# EAGLE schematic Becca Sap Flow Sensor MOD3 (EAGLE 9.6.2)
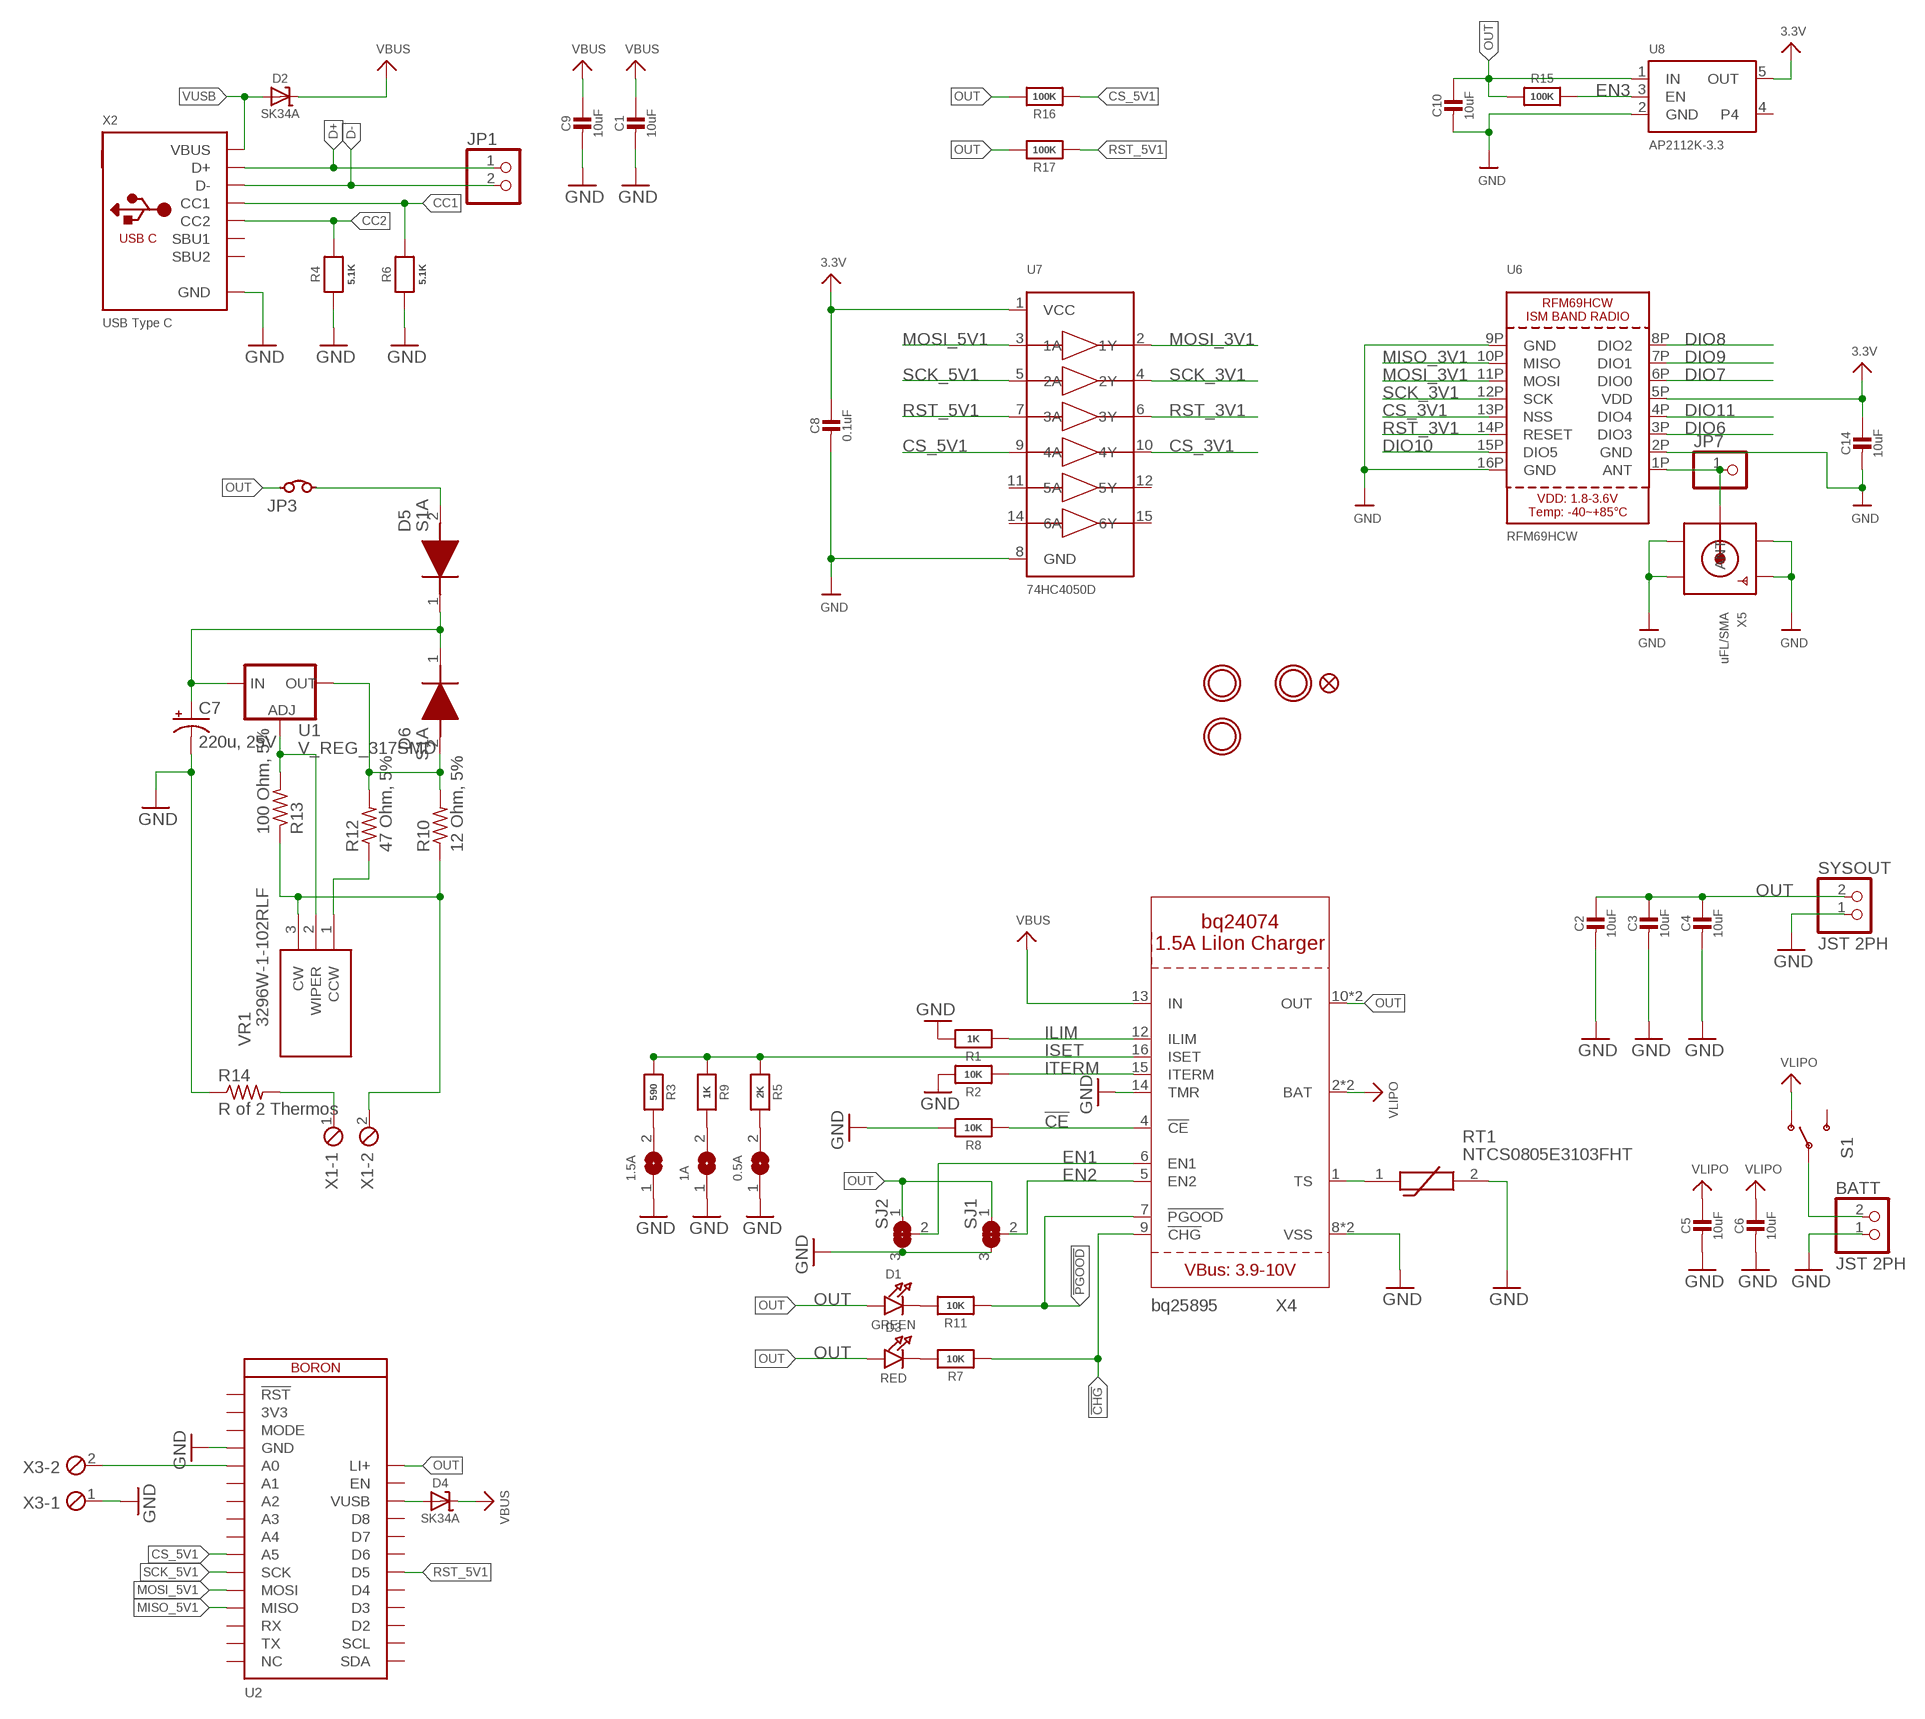
[diagram p0: schematic, sheet 1]

## Parts
0.5A  SOLDERJUMPER  [SOLDERJUMPER_ARROW_NOPASTE]
1.5A  SOLDERJUMPER  [SOLDERJUMPER_ARROW_NOPASTE]
1A  SOLDERJUMPERCLOSED  [SOLDERJUMPER_CLOSEDWIRE]
BATT  JST 2PH  JST_2PIN-THM-RA  [JST-PH-2-THM-RA]
C1  10uF  CAP_CERAMIC0805-NOOUTLINE  [0805-NO]
C2  10uF  CAP_CERAMIC0805-NOOUTLINE  [0805-NO]
C3  10uF  CAP_CERAMIC0805-NOOUTLINE  [0805-NO]
C4  10uF  CAP_CERAMIC0805-NOOUTLINE  [0805-NO]
C5  10uF  CAP_CERAMIC0805-NOOUTLINE  [0805-NO]
C6  10uF  CAP_CERAMIC0805-NOOUTLINE  [0805-NO]
C7  220u, 25V  CPOL-USC  [PANASONIC_C]
C8  0.1uF  CAP_CERAMIC0805-NOOUTLINE  [0805-NO]
C9  10uF  CAP_CERAMIC0805-NOOUTLINE  [0805-NO]
C10  10uF  CAP_CERAMIC0805-NOOUTLINE  [0805-NO]
C14  10uF  CAP_CERAMIC0805-NOOUTLINE  [0805-NO]
D1  GREEN  LED0603  [CHIPLED_0603]
D2  SK34A  DIODE-SCHOTTKYSMA  [SMADIODE]
D3  RED  LED0603  [CHIPLED_0603]
D4  SK34A  DIODE-SCHOTTKYSMA  [SMADIODE]
D5  S1A  [DIOM5027X250N]
D6  S1A  [DIOM5027X250N]
FID2  FIDUCIAL_1MM  [FIDUCIAL_1MM]
JP1  HEADER-1X2ROUND  [1X02_ROUND]
JP3  JUMPER  [HDR2X1]
JP7  HEADER-1X1ROUND  [1X01_ROUND]
R1  1K  RESISTOR_0603_NOOUT  [0603-NO]
R2  10K  RESISTOR_0603_NOOUT  [0603-NO]
R3  590  RESISTOR_0603_NOOUT  [0603-NO]
R4  5.1K  RESISTOR_0603_NOOUT  [0603-NO]
R5  2K  RESISTOR_0603_NOOUT  [0603-NO]
R6  5.1K  RESISTOR_0603_NOOUT  [0603-NO]
R7  10K  RESISTOR_0603_NOOUT  [0603-NO]
R8  10K  RESISTOR_0603_NOOUT  [0603-NO]
R9  1K  RESISTOR_0603_NOOUT  [0603-NO]
R10  12 Ohm, 5%  R-US_R0805  [R0805]
R11  10K  RESISTOR_0603_NOOUT  [0603-NO]
R12  47 Ohm, 5%  R-US_R0805  [R0805]
R13  100 Ohm, 5%  R-US_R0805  [R0805]
R14  R of 2 Thermos  R-US_R0805  [R0805]
R15  100K  RESISTOR0805_NOOUTLINE  [0805-NO]
R16  100K  RESISTOR0805_NOOUTLINE  [0805-NO]
R17  100K  RESISTOR0805_NOOUTLINE  [0805-NO]
RT1  NTCS0805E3103FHT  [THRMC2012X95N]
S1  SWITCH-SPDTSMD  [SWITCH_SPDT_SMD]
SJ1  SOLDERJUMPER_2WAY  [SOLDERJUMPER_2WAY_OPEN_NOPASTE]
SJ2  SOLDERJUMPER_2WAY  [SOLDERJUMPER_2WAY_OPEN_NOPASTE]
SYSOUT  JST 2PH  JST_2PIN-THM-RA  [JST-PH-2-THM-RA]
U1  V_REG_317SMD  [SOT223]
U2  BORON  [BORON]
U6  RFM69HCW  RFM69HCW_SMT  [RFMHCW_SMT]
U7  74HC4050D  74HC4050DTSSOP  [TSSOP16]
U8  AP2112K-3.3  VREG_SOT23-5  [SOT23-5]
U$3  MOUNTINGHOLE2.5  [MOUNTINGHOLE_2.5_PLATED]
U$4  MOUNTINGHOLE2.5  [MOUNTINGHOLE_2.5_PLATED]
U$11  MOUNTINGHOLE2.5  [MOUNTINGHOLE_2.5_PLATED]
VR1  3296W-1-102RLF  [3296W1102RLF]
X1  MPT2  [2POL254]
X2  USB Type C  USB_C  [USB_C_CUSB31-CFM2AX-01-X]
X3  MPT2  [2POL254]
X4  BQ24074  [QFN16_3MM]
X5  uFL/SMA  SMACONNECTOR_EDGE_UFL  [SMA_EDGELAUNCH_UFL]

## Nets
3.3V: C8.1 C14.1 U6.5P(VDD) U7.1(VCC) U8.5(OUT)
!CE: R8.1 X4.4(!CE)
!CHG: R7.1 X4.9(!CHG)
!PGOOD: R11.1 X4.7(!PGOOD)
CC1: R6.2 X2.A5(CC1)
CC2: R4.2 X2.B5(CC2)
CS_3V1: U6.13P(NSS) U7.10(4Y)
CS_5V1: R16.1 U2.10(A5) U7.9(4A)
D+: JP1.1 X2.A6(D+) X2.B6(D+)
D-: JP1.2 X2.A7(D-) X2.B7(D-)
DIO6: U6.3P(DIO3)
DIO7: U6.6P(DIO0)
DIO8: U6.8P(DIO2)
DIO9: U6.7P(DIO1)
DIO10: U6.15P(DIO5)
DIO11: U6.4P(DIO4)
EN1: SJ2.2 X4.6(EN1)
EN2: SJ1.2 X4.5(EN2)
EN3: R15.2 U8.3(EN)
GND: 0.5A.1 1.5A.1 1A.1 BATT.1 C1.2 C2.2 C3.2 C4.2 C5.2 C6.2 C7.- C8.2 C9.2 C10.2 C14.2 R1.2 R2.2 R4.1 R6.1 R8.2 R14.1 RT1.2 SJ1.3 SJ2.3 SYSOUT.1 U2.4(GND) U6.2P(GND) U6.9P(GND) U6.16P(GND) U7.8(GND) U8.2(GND) X2.A1B12(GND) X2.B1A12(GND) X3.1 X4.8(VSS) X4.14(TMR) X4.THERMAL(VSS) X5.GND@1(GND1) X5.GND@2(GND2) X5.GND@3(GND3) X5.GND@4(GND4)
ILIM: R1.1 X4.12(ILIM)
ISET: R3.1 R5.1 R9.1 X4.16(ISET)
ITERM: R2.1 X4.15(ITERM)
MISO_3V1: U6.10P(MISO)
MISO_5V1: U2.13(MISO)
MOSI_3V1: U6.11P(MOSI) U7.2(1Y)
MOSI_5V1: U2.12(MOSI) U7.3(1A)
N$1: D1.C R11.2
N$2: BATT.2 S1.2(P)
N$3: D3.C R7.2
N$5: 1.5A.2 R3.2
N$6: 0.5A.2 R5.2
N$7: 1A.2 R9.2
N$9: RT1.1 X4.1(TS)
N$10: D5.2(A) JP3.2
N$11: C7.+ D5.1(K) D6.1(K) U1.3(IN)
N$12: D6.2(A) R10.2 R12.2 U1.2(OUT)
N$13: R14.2 X1.1
N$14: R13.2 U1.1(ADJ) VR1.2(WIPER)
N$15: R12.1 VR1.1(CCW)
N$16: R10.1 R13.1 VR1.3(CW) X1.2
N$17: U2.5(A0) X3.2
N$18: JP7.1 U6.1P(ANT) X5.P(ANT)
OUT: C2.1 C3.1 C4.1 C10.1 D1.A D3.A JP3.1 R15.1 R16.2 R17.2 SJ1.1 SJ2.1 SYSOUT.2 U2.28(LI+) U8.1(IN) X4.10(OUT) X4.11(OUT)
RST_3V1: U6.14P(RESET) U7.6(3Y)
RST_5V1: R17.1 U2.22(D5) U7.7(3A)
SCK_3V1: U6.12P(SCK) U7.4(2Y)
SCK_5V1: U2.11(SCK) U7.5(2A)
VBUS: C1.1 C9.1 D2.C D4.C X4.13(IN)
VLIPO: C5.1 C6.1 S1.1(O) X4.2(BAT) X4.3(BAT)
VUSB: D2.A X2.A4B9(VBUS) X2.B4A9(VBUS)
VUSB1: D4.A U2.26(VUSB)
Unconnected: S1.3(S) U2.1(!RST) U2.3(MODE) U2.6(A1) U2.7(A2) U2.8(A3) U2.9(A4) U2.14(RX) U2.15(TX) U2.16(NC) U2.17(SDA) U2.18(SCL) U2.19(D2) U2.20(D3) U2.21(D4) U2.23(D6) U2.24(D7) U2.25(D8) U2.27(EN) U7.11(5A) U7.12(5Y) U7.14(6A) U7.15(6Y) U8.4 X2.A8(SBU1) X2.B8(SBU2)

## Power pins joined to a net without a drawn wire
3V3: U2.2(3V3)

## Library data of the parts
0.5A 1.5A = microbuilder:SOLDERJUMPER: SMD Solder JUMPER Solder the two pads together to create a connection, or remove the solder to break it. REFLOW - Use this footprint for solder paste and reflow ovens. WAVE - Use this footprint for hand-soldering (larger pads). CLOSED - Has a trace between the two pads to ensure it is closed by default. The trace needs to be cut to disable the jumper, and can be closed again by creating a solder bridge between the two pads.; BOM: EXCLUDE
1A = microbuilder:SOLDERJUMPER: SMD Solder JUMPER Solder the two pads together to create a connection, or remove the solder to break it. REFLOW - Use this footprint for solder paste and reflow ovens. WAVE - Use this footprint for hand-soldering (larger pads). CLOSED - Has a trace between the two pads to ensure it is closed by default. The trace needs to be cut to disable the jumper, and can be closed again by creating a solder bridge between the two pads.
BATT SYSOUT = adafruit:JST_2PIN: JST 2-Pin Connectors of various flavors SMT-RA (S2B-PH-SM4) 4UConnector #17311 SMT (B2B-PH-SM4) THM-RA (S2B-PH) THM (B2B-PH)
C1-C6 C8-C10 C14 = microbuilder:CAP_CERAMIC: Ceramic Capacitors For new designs, use the packages preceded by an '_' character since they are more reliable: The following footprints should be used on most boards: _0402 - Standard footprint for regular board layouts _0603 - Standard footprint for regular board layouts _0805 - Standard footprint for regular board layouts _1206 - Standard footprint for regular board layouts For extremely tight-pitch boards where space is at a premium, the following 'micro-pitch' footprints can be used (smaller pads, no silkscreen outline, etc.): _0402MP - Micro-pitch footprint for very dense/compact boards _0603MP - Micro-pitch footprint for very dense/compact boards _0805MP - Micro-pitch footprint for very dense/compact boards _1206MP - Micro-pitch footprint for very dense/compact boards
C7 = rcl:CPOL-US: POLARIZED CAPACITOR, American symbol; SPICEPREFIX: C
D1 D3 = microbuilder:LED: LED 0603 - 0603 Surface Mount Package 2mA: Green LED - Low Power (3.9mcd, 2ma, 1.7Vf) - Digikey: 475-2709-2-ND Orange LED - Low Power (9.8mcd, 2ma, 1.8Vf) - Digikey: 475-1194-2-ND Red LED - Low Power (5mcd, 2ma, 1.8Vf) - Digikey: 475-1195-2-ND Yellow LED - Low Power (7mcd, 2ma, 1.8Vf) - Digikey: 475-1196-2-ND 5mA: Blue LED - Low Power (17mcd, 5ma, 2.9Vf) - Digikey: LNJ937W8CRACT-ND 0805 - 0805 Surface Mount Package 2mA: Red LED (8.8mcd, 2mA, 1.8Vf, Clear) - Low Power [Digikey: 475-2510-1-ND] Green LED (5mcd, 2mA, 1.8Vf, Clear) - Low Power [Digikey: 475-2730-1-ND] Yellow LED (11.3mcd, 2mA, 1.8Vf, Clear) - Low Power [Digikey: 475-2555-1-ND] 20mA: Red LED (104mcd, 20mA, Diffused) - LS R976 [Digikey: 475-1278-6-ND] Red LED (12mcd, 20mA, 2.0Vf, Clear) - APT2012EC [Digikey: 754-1128-1-ND] Green LED (15mcd, 20mA, 2.2Vf, Clear) - APT2012GC [Digikey: 754-1131-1-ND] Orange LED (160mcd, 20mA, 2.1Vf, Clear) - APT2012SECK [Digikey: 754-1130-1-ND] 1206 - 1206 Surface Mount Package Green LED (26mcd, 20mA, Diffused) - LG N971 [Digikey: 475-1407-6-ND] Red LED (15mcd, 20mA, Diffused) - LH N974 [Digikey: 475-1416-6-ND] Cree - Cree High-Power Surface Mount LEDs XPEBWT-L1-0000-00D50 - White 111lm 350mA 2.9Vf 6200K 110° XTEAWT-00-0000-00000LEE3 - White 114lm 350mA 2.85Vf 5000K 115° Everlight - Everlight 45-21 Series Surface Mount LEDs 45-21/QK2C-B2832AC2CB2/2T - Warm White 2000mcd 20mA 3.25Vf 3050K 120° 45-21/LK2C-B38452C4CB2/2T - Nuetral White 2000mcd 20mA 3.25Vf 4150K 120° 45-21/LK2C-B50634C6CB2/2T - Cold White 2200mcd 20mA 3.25Vf 5650K 120° PLCC2 Reverse Mount LS T77K-J1L2-1-0-2-R18-Z - Red 11.25mcd 2mA 1.8Vf 630nm 120° LO T77K-L1M2-24-Z - Orange 19.6mcd 2mA 1.8Vf 606nm 120° LY T77K-K2M1-26-Z - Yellow 15.7mcd 2mA 1.8Vf 587nm 120°
D2 D4 = microbuilder:DIODE-SCHOTTKY
D5 D6 = S1A:S1A: Rectifier Diode Switching 50V 1A 1500ns 2-Pin SMA T/R Source: Datasheet <https://diotec.com/request/datasheet/s1a.pdf>; DESCRIPTION: Rectifier Diode Switching 50V 1A 1500ns 2-Pin SMA T/R; HEIGHT: 2.5mm; MANUFACTURER_NAME: Diotec; MANUFACTURER_PART_NUMBER: S1A; MOUSER_PART_NUMBER: 637-S1A; MOUSER_PRICE-STOCK: https://www.mouser.co.uk/ProductDetail/Diotec-Semiconductor/S1A?qs=OlC7AqGiEDlqVjQP70PTqA%3D%3D
FID2 = microbuilder:FIDUCIAL: Fiducial Alignment Points Various fiducial points for machine vision alignment.; BOM: EXCLUDE
JP1 = microbuilder:HEADER-1X2: PIN HEADER
JP3 = 6P1_EVB:JUMPER: Wire jumper .1" C
JP7 = microbuilder:HEADER-1X1: PIN HEADER
R1-R9 R11 R15-R17 = microbuilder:RESISTOR: Resistors For new designs, use the packages preceded by an '_' character since they are more reliable: The following footprints should be used on most boards: _0402 - Standard footprint for regular board layouts _0603 - Standard footprint for regular board layouts _0805 - Standard footprint for regular board layouts _1206 - Standard footprint for regular board layouts For extremely tight-pitch boards where space is at a premium, the following 'micro-pitch' footprints can be used (smaller pads, no silkscreen outline, etc.): _0402MP - Micro-pitch footprint for very dense/compact boards _0603MP - Micro-pitch footprint for very dense/compact boards _0805MP - Micro-pitch footprint for very dense/compact boards _1206MP - Micro-pitch footprint for very dense/compact boards
R10 R12-R14 = rcl:R-US_: RESISTOR, American symbol; SPICEPREFIX: R
RT1 = NTCS0805E3103FHT:NTCS0805E3103FHT: NTC Thermistors NTC 10Kohms 1% Source: Datasheet <http://www.vishay.com/docs/29044/ntcs0805e3t.pdf>; DESCRIPTION: NTC Thermistors NTC 10Kohms 1%; HEIGHT: 0.95mm; MANUFACTURER_NAME: Vishay; MANUFACTURER_PART_NUMBER: NTCS0805E3103FHT; MOUSER_PART_NUMBER: 594-NTCS0805E3103FHT; MOUSER_PRICE-STOCK: https://www.mouser.co.uk/ProductDetail/Vishay-BC-Components/NTCS0805E3103FHT?qs=%2FWiulJ9oly74KIuevFiaAw%3D%3D
S1 = SparkFun-Retired:SWITCH-SPDT: SPDT Switch Simple slide switch, Spark Fun Electronics SKU : COM-00102 DPDT SMT slide switch, AYZ0202, SWCH-08179
SJ1 SJ2 = microbuilder:SOLDERJUMPER_2WAY: 2-Way Solder Jumper
U1 = SparkFun-IC-Power:V_REG_317: Voltage Regulator Standard LM317 adjustable voltage regulator. AOI (Adjust Output Input). Google 'LM317 Calculator' for easy to use app to get the two resistor values needed. 240/720 for 5V output. 240/390 for 3.3V output. Spark Fun Electronics SKU : COM-00527
U2 = Particle-Devices:BORON: BORON The Particle Boron cellular enabled development kit that can act as either a standalone cellular device or LTE enabled gateway, repeater, or endpoint for a Particle Mesh networks. More information: https://docs.particle.io/boron/ Footprint and formfactor based on Adafruit Feather. <https://www.adafruit.com/feather>
U6 = microbuilder:RFM69HCW: RFM69HCW - ISM Band RF Transceiver
U7 = microbuilder:74HC4050D: 6-channel level shifter 74HC4050D - 2V-6V Supply SOIC16 Digikey: 74HC4050D,653-ND Mouser: 771-74HC4050D-T TSSOP16 Digikey: 296-9215-1-ND Mouser:
U8 = microbuilder:VREG_SOT23-5: SOT23-5 Fixed Voltage Regulators Part Current Out V Out V In V Dropout θJA (°C/W) TJ (°C) Digikey Part No. ADP121 150mA 3.3V 3.4-5.5V 0.09V @ 150mA -- -- ADP121-AUJZ33R7CT-ND ADP121 150mA 3.0V 3.1-5.5V 0.09V @ 150mA -- -- ADP121-AUJZ30R7CT-ND ADP122 300mA 3.3V 3.4-5.5V 0.085V @ 300mA -- -- ADP122AUJZ-3.3-R7CT-ND ADP1712 300mA 3.3V 3.5-5.5V 0.17V @ 300mA -- -- ADP1712AUJZ-3.3-R7TR-ND AP7311 (Low Cost) 150mA 3.3V 3.5-6V 0.15V @ 150mA -- -- AP7311-33WG-7DICT-ND LD39015M18R 150mA 1.8V 1.9V-5.5V 0.08V @ 100mA -- -- 497-6977-1-ND LP2985A-33DBVR 150mA 3.3V 3.3-16V 0.28V @ 150mA 206 150 296-18479-1-ND MCP1824T-3302E/OT 300mA 3.3V 3.5V-6V 0.2V @ 300mA -- -- MCP1824T-3302E/OTCT-ND MIC5205-2.5YM5 TR 150mA 2.5V 2.7-16V 0.165V @ 150mA -- -- 576-1257-2-ND MIC5205-3.0YM5 TR 150mA 3.0V 3.2V-16V 0.165V @ 150mA -- -- 576-1258-2-ND MIC5205-3.3YM5 TR 150mA 3.3V 3.5V-16V 0.165V @ 150mA -- -- 576-1259-2-ND TPS780330220 150mA 3.3V+2.2V 3.6-5.5V 250mV Max -- -- 296-23332-1-ND TDA3663/N1,135 100mA 3.3V 3.5-45V 0.18V @ 50mA -- -- 568-5343-1-ND Max operating temp can be calculated using θJA, TJ (max junction temperature), and power in watts. Set the "Maximum Ambient Temperature" until it reaches TJ ("Max Junction Temperature"), which is the absolute limit for safe use of the regulator: Heat Sink Temperature Calculator <http://www.daycounter.com/Calculators/Heat-Sink-Temperature-Calculator.phtml> For example, With 12V source into a 3.3V LP2985 and a 30mA load, we are dissipating (12V-3.3V) * 0.03A = 0.261W. With a θJA of 206 °C/W, a TJ of 150°C, and 261mW we can safely use the chip without a heat sink up to 75°C (=147.1°C Junction Temperature).
U$3 U$4 U$11 = microbuilder:MOUNTINGHOLE: Mounting Hole For #2 screws (0.086"/2.18mm width, 0.094"/2.4mm hole) use 2.5mm; BOM: EXCLUDE
VR1 = 3296W-1-102RLF:3296W-1-102RLF: 1 kOhms 0.5W, 1/2W PC Pins Through Hole Trimmer Potentiometer Cermet 25.0 Turn Top Adjustment Source: Datasheet <https://www.bourns.com/docs/Product-Datasheets/3296.pdf>; DESCRIPTION: 1 kOhms 0.5W, 1/2W PC Pins Through Hole Trimmer Potentiometer Cermet 25.0 Turn Top Adjustment; HEIGHT: 11.8mm; MANUFACTURER_NAME: Bourns; MANUFACTURER_PART_NUMBER: 3296W-1-102RLF; MOUSER_PART_NUMBER: 652-3296W-1-102RLF; MOUSER_PRICE-STOCK: https://www.mouser.co.uk/ProductDetail/Bourns/3296W-1-102RLF?qs=oM%2FE6%2FUWOpR5bwX1MfrWeA%3D%3D
X1 X3 = con-phoenix-254:MPT2: PHOENIX CONNECTOR; OC_FARNELL: unknown; OC_NEWARK: unknown
X2 = microbuilder:USB_C: USB Type-C USB 2.0 Connector
X4 = adafruit_power:BQ24074
X5 = microbuilder:SMACONNECTOR: SMA Connector 90° DIP SMA Connector, 50 Ohm (4UConnector: 07259)

## Net classes
1 highpower: width 0.305 mm, drill 0.483 mm